# EasyEDA Pro project BLDC_DRIVER_REUSEPhase.eprj

# Schematic singlephaseschem
Create Date: 2024-09-21; Page Name: P1; Project Name: BLDC_DRIVER_REUSEPhase; Schematic Name: singlephaseschem; Update Date: 2024-09-21; Company: EasyEDA.com; Drawn: EasyEDA; Page Size: A4; Part Number: JLCPCB-002; Reviewed: EasyEDA; Version: V0.1
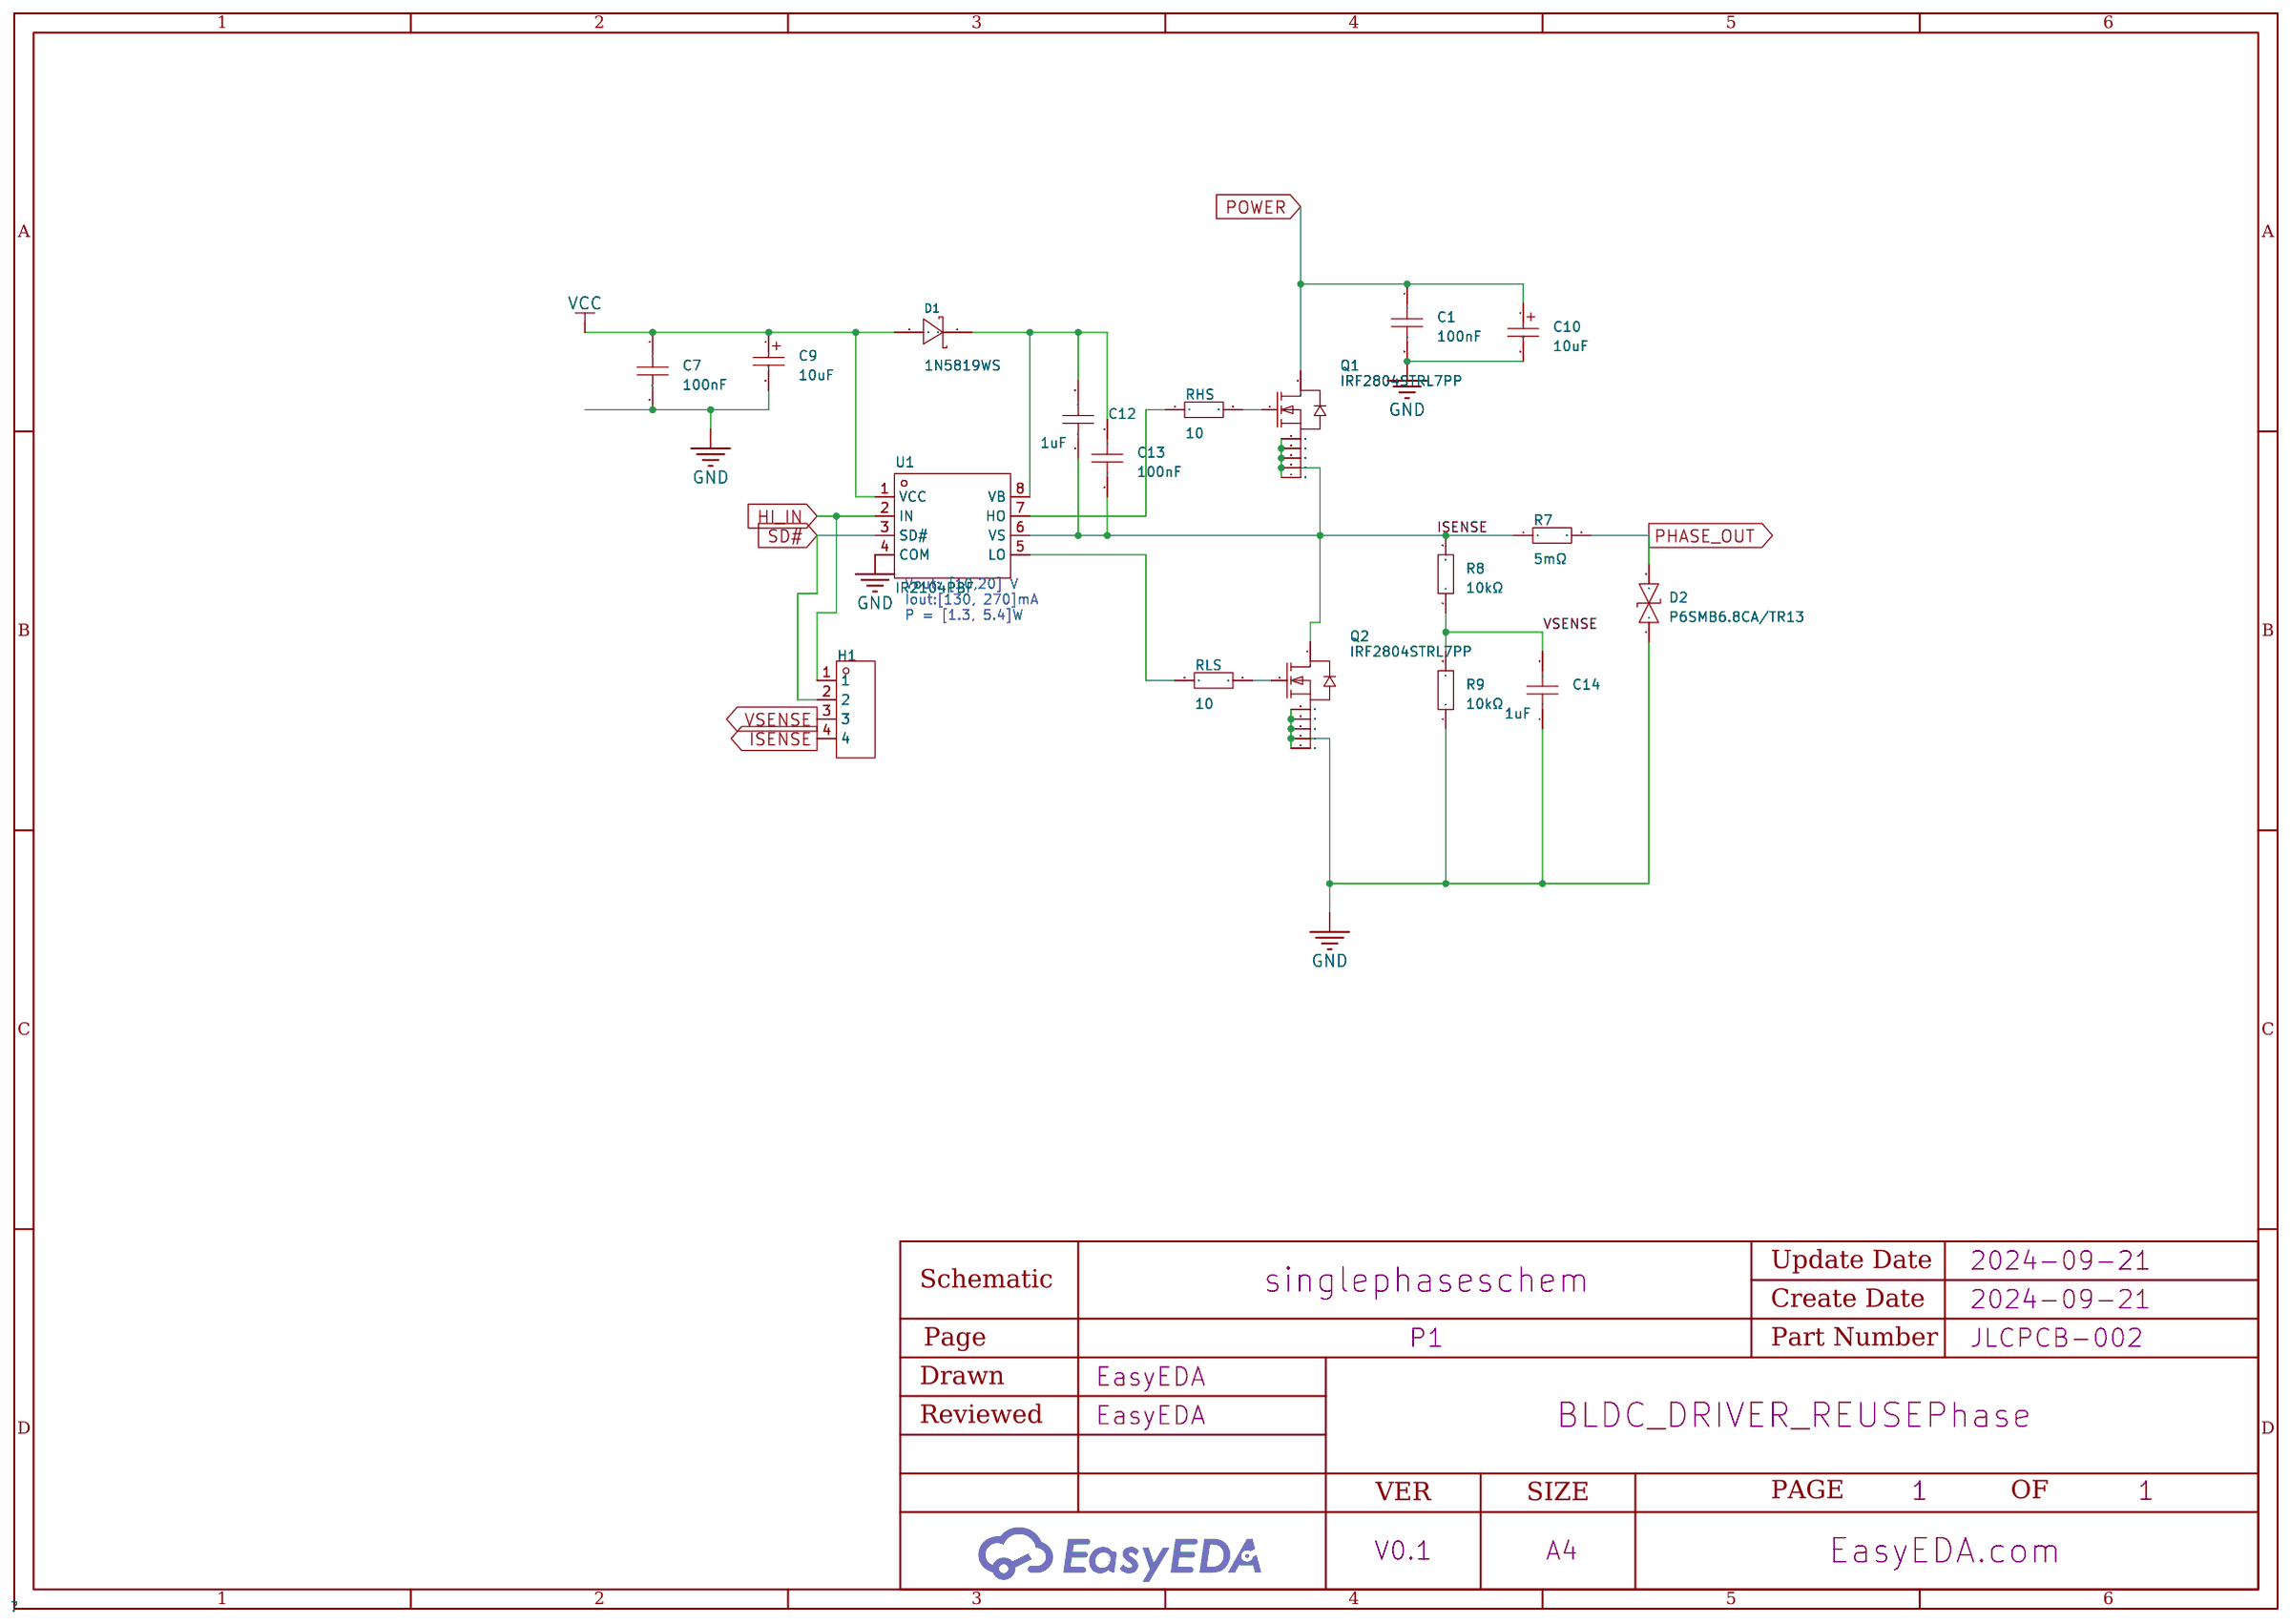
[diagram p0: schematic sheet]

## Parts
C1  100nF  [C0603]
C7  100nF  [C0603]
C9  10uF  [CAP-SMD_BD5.0-L5.3-W5.3-LS6.3-FD]
C10  10uF  [CAP-SMD_BD5.0-L5.3-W5.3-LS6.3-FD]
C12  1uF  [CAP-TH_L7.2-W2.5-P5.00-D0.6]
C13  100nF  [C0603]
C14  1uF  [CAP-TH_L7.2-W2.5-P5.00-D0.6]
D1  1N5819WS  [SOD-323_L1.8-W1.3-LS2.5-RD]
D2  P6SMB6.8CA/TR13  [SMB_L4.6-W3.6-LS5.3-BI]
H1  -  [HDR-TH_4P-P2.54-V-M]
Q1  IRF2804STRL7PP  [D2PAK-7_L10.6-W9.6-P1.27-LS15.9-BR]
Q2  IRF2804STRL7PP  [D2PAK-7_L10.6-W9.6-P1.27-LS15.9-BR]
R7  5mΩ  [R2512]
R8  10kΩ  [RES-TH_BD3.3-L9.0-P13.00-D0.6]
R9  10kΩ  [RES-TH_BD3.3-L9.0-P13.00-D0.6]
RHS  10  [R1210]
RLS  10  [R1210]
U1  IR2104PBF  [DIP-8_L9.9-W6.6-P2.54-LS7.62-BL]

## Library data of the parts
C1 C7 C13 = CAP_0603: Supplier Footprint: 0603
C9 C10 = C_Ele_SMD_5x5.4mm: Supplier Footprint: SMD,5x5.4mm
C12 C14 = SMEC334J100M2: Capacitance: Tolerance:±5% Tolerance:±5% Voltage Rated:; LCSC Part Name: 330nF ±5% 100V; Supplier Part: C401104; Manufacturer: CHAMPION(全鹏); Supplier Footprint: 插件,P=5mm; JLCPCB Part Class: Extended Part; Datasheet: https://atta.szlcsc.com/upload/public/pdf/source/20190730/C401104_3330673C3D333BC9993FC47731C2A492.pdf; Supplier: LCSC; Tolerance: ±5%
D1 = 1N5819WS_C191023: Forward Voltage (Vf@If):600mV@1A Reverse Voltage (Vr):40V Average Rectified Current (Io):1A; LCSC Part Name: 电压:40V 电流:1A; Supplier Part: C191023; Manufacturer: Hottech(合科泰); Supplier Footprint: SOD-323; JLCPCB Part Class: Basic Part; Datasheet: https://atta.szlcsc.com/upload/public/pdf/source/20220428/3CB86FD8D28D653594B4E35F9D5AEFD9.pdf; Supplier: LCSC; Forward Voltage (Vf@If): 600mV@1A; Reverse Voltage (Vr): 40V; Average Rectified Current (Io): 1A
D2 = P6SMB6.8CA/TR13: Reverse Stand-Off Voltage (Vrwm):5.8V Maximum Clamping Voltage:10.5V Peak Pulse Current (Ipp)@10/1000us:58.1A Peak Pulse Power Dissipation (Ppp)@10/1000us:600W Breakdown Voltage:6.45V Type:TVS; Supplier Part: C78395; Manufacturer: Brightking(君耀电子); Supplier Footprint: SMB(DO-214AA); JLCPCB Part Class: Basic Part; Datasheet: https://atta.szlcsc.com/upload/public/pdf/source/20160709/1468031879762.pdf; Supplier: LCSC; Reverse Stand-Off Voltage (Vrwm): 5.8V; Maximum Clamping Voltage: 10.5V; Peak Pulse Current (Ipp)@10/1000us: 58.1A; Peak Pulse Power Dissipation (Ppp)@10/1000us: 600W; Breakdown Voltage: 6.45V; Type: TVS
H1 = HDR-M_2.54_1x4P: Supplier Footprint: Through
Q1 Q2 = IRF2804STRL7PP: Supplier Part: C459950; Manufacturer: Infineon(英飞凌); Supplier Footprint: TO-252-3; JLCPCB Part Class: Extended Part; Datasheet: https://atta.szlcsc.com/upload/public/pdf/source/20211220/39CD65D483719D465F1A88FFAD2C5DF5.pdf; Supplier: LCSC
R7 = PA2512FKF7W0R005E: Type:Current Sensing Resistors Resistance: Tolerance:±1% Tolerance:±1% Power(Watts): Temperature Coefficient:±100ppm/℃ Temperature Coefficient:±100ppm/℃; LCSC Part Name: 5mΩ ±1% 2W; Supplier Part: C309526; Manufacturer: YAGEO(国巨); Supplier Footprint: 2512; JLCPCB Part Class: Extended Part; Datasheet: https://atta.szlcsc.com/upload/public/pdf/source/20190227/C375693_219964CC8B3EBD36DBDF701587FA5938.pdf; Supplier: LCSC; Type: Current Sensing Resistors; Tolerance: ±1%; Temperature Coefficient: ±100ppm/℃
R8 R9 = Res_AXIAL-1/2W: Supplier Footprint: Through
RHS RLS = Res_1210: Supplier Footprint: 1210
U1 = IR2104PBF: Driven Configuration:Half Bridge Load Type:MOSFET；IGBT Number of Drivers:2 Peak Output Current(sink):360mA Peak Output Current(source):210mA Supply Voltage:10V~20V Supply Voltage:10V~20V Rise Time:100ns Fall Time:50ns Operating Temperature:-40℃~+150℃@(Tj); LCSC Part Name: IR2104PBF 停产; Supplier Part: C2959; Manufacturer: Infineon(英飞凌); Supplier Footprint: PDIP-8; JLCPCB Part Class: Extended Part; Datasheet: https://atta.szlcsc.com/upload/public/pdf/source/20140906/1457707236579.pdf; Supplier: LCSC; Driven Configuration: Half Bridge; Load Type: MOSFET；IGBT; Number of Drivers: 2; Peak Output Current(sink): 360mA; Peak Output Current(source): 210mA; Supply Voltage: 10V~20V; Rise Time: 100ns; Fall Time: 50ns; Operating Temperature: -40℃~+150℃@(Tj)

## Nets
GND: C1.2 C7.2 C9.2 C10.2 C14.1 D2.1 Q2.2(S) Q2.3(S) Q2.5(S) Q2.6(S) Q2.7(S) R9.1 U1.4(COM)
VCC: C7.1 C9.1 D1.2(A) U1.1(VCC)
HI_IN: H1.1 U1.2(IN)
ISENSE: C12.1 C13.2 H1.4 Q1.2(S) Q1.3(S) Q1.5(S) Q1.6(S) Q1.7(S) Q2.4(D) R7.1 R8.2 U1.6(VS)
PHASE_OUT: D2.2 R7.2
POWER: C1.1 C10.1 Q1.4(D)
SD#: H1.2 U1.3(SD#)
VSENSE: C14.2 H1.3 R8.1 R9.2
$1N697: RHS.1 U1.7(HO)
$1N698: Q1.1(G) RHS.2
$1N699: RLS.1 U1.5(LO)
$1N700: Q2.1(G) RLS.2
$1N2600: C12.2 C13.1 D1.1(K) U1.8(VB)

## Notes on the sheet
- Vout: [10,20] V
  Iout:[130, 270]mA
  P = [1.3, 5.4]W

# Board PCB4_1
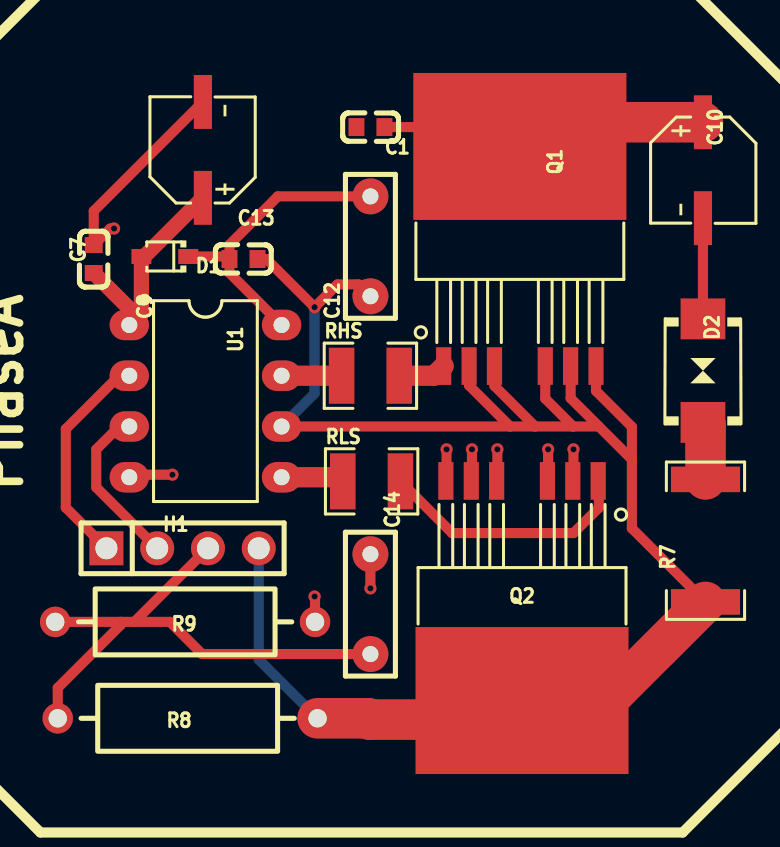
[diagram p1: board, top side]
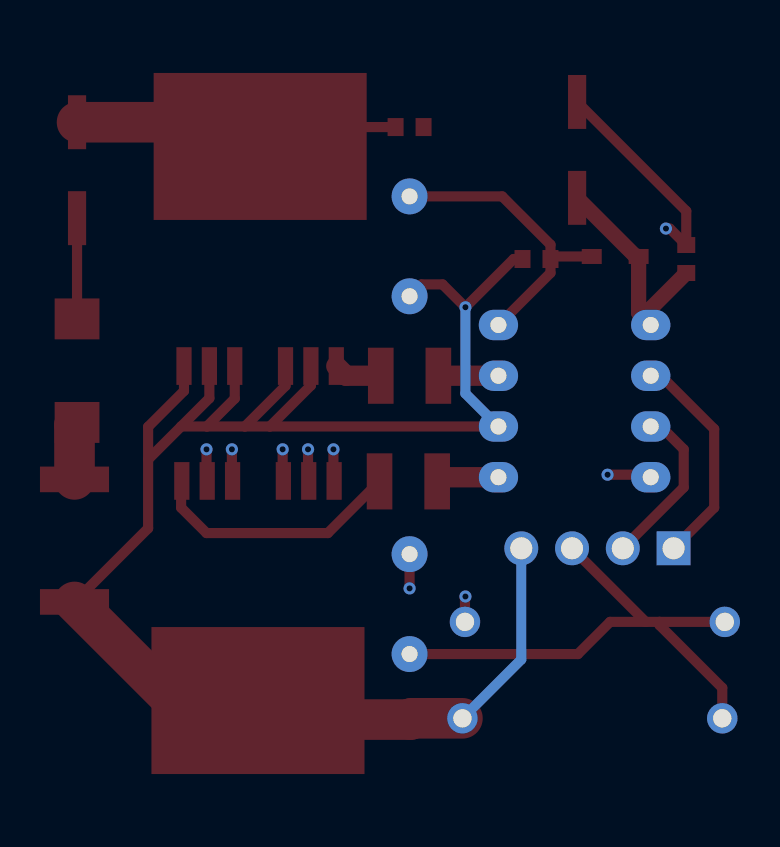
[diagram p2: board, bottom side, seen from below]

No outline. copper layers: Top Layer, Bottom Layer. Coordinates in mm from the lowest, leftmost part position.
Stack: Top Layer 0.035mm / Dielectric1 1.51mm FR4 er 4.5 / Bottom Layer 0.035mm

## Design rules (mm)
template: JLCPCB Capability(Two Layers Board)
spacing copperThickness1oz (default): track to track 0.102, other pairs 0.152 to 0.3
spacing copperThickness2oz: track to track 0.203, other pairs 0.152 to 0.3
track width copperThickness1oz (default): min 0.127, default 0.254, max 2.54
track width copperThickness2oz: min 0.203, default 0.254, max 2.54
differential pair differentialPair (default): width min 0.127, default 0.254, max 2.54; gap min 0.152, default 0.152
via viaSize (default): diameter min 0.5, default 0.61, max 10; hole min 0.3, default 0.305, max 6.3

## Placement (name value [footprint] x y rotation side)
C1  100nF  [C0603]  13.84 29.59 180 top
C7  100nF  [C0603]  0 22.99 90 top
C9  10uF  [CAP-SMD_BD5.0-L5.3-W5.3-LS6.3-FD]  5.46 28.45 90 top
C10  10uF  [CAP-SMD_BD5.0-L5.3-W5.3-LS6.3-FD]  30.48 27.43 270 top
C12  1uF  [CAP-TH_L7.2-W2.5-P5.00-D0.6]  13.84 23.62 90 top
C13  100nF  [C0603]  7.49 22.99 0 top
C14  1uF  [CAP-TH_L7.2-W2.5-P5.00-D0.6]  13.84 5.72 270 top
D1  1N5819WS  [SOD-323_L1.8-W1.3-LS2.5-RD]  3.56 23.11 180 top
D2  P6SMB6.8CA/TR13  [SMB_L4.6-W3.6-LS5.3-BI]  30.48 17.4 270 top
H1  -  [HDR-TH_4P-P2.54-V-M]  4.44 8.51 0 top
Q1  IRF2804STRL7PP  [D2PAK-7_L10.6-W9.6-P1.27-LS15.9-BR]  21.32 23.12 270 top
Q2  IRF2804STRL7PP  [D2PAK-7_L10.6-W9.6-P1.27-LS15.9-BR]  21.43 6.38 90 top
R7  5mΩ  [R2512]  30.61 8.89 90 top
R8  10kΩ  [RES-TH_BD3.3-L9.0-P13.00-D0.6]  4.7 0 0 top
R9  10kΩ  [RES-TH_BD3.3-L9.0-P13.00-D0.6]  4.57 4.83 180 top
RHS  10  [R1210]  13.84 17.14 0 top
RLS  10  [R1210]  13.9 11.86 0 top
U1  IR2104PBF  [DIP-8_L9.9-W6.6-P2.54-LS7.62-BL]  5.59 15.88 270 top

## Footprints (pads in the part's own frame, mm; a bottom-side part is the same pattern mirrored in y, then rotated)
C0603
  rect 0.8x0.9 smd: 1(-0.7,0) 2(0.7,0)
CAP-SMD_BD5.0-L5.3-W5.3-LS6.3-FD
  rect 2.7x0.91 smd: 1(-2.4,0) 2(2.4,0)
CAP-TH_L7.2-W2.5-P5.00-D0.6
  round 1.8 hole 0.8: 1(-2.499,0) 2(2.499,0)
D2PAK-7_L10.6-W9.6-P1.27-LS15.9-BR
  rect 1.887x0.762 smd: 1(5.495,-3.81) 2(5.495,-2.54) 3(5.495,-1.27) 5(5.495,1.27) 6(5.495,2.54) 7(5.495,3.81)
  rect 7.356x10.66 smd: 4(-5.495,0)
DIP-8_L9.9-W6.6-P2.54-LS7.62-BL
  oval 1.524x1.97 hole 0.8: 1(-3.81,-3.81) 2(-1.27,-3.81) 3(1.27,-3.81) 4(3.81,-3.81) 5(3.81,3.81) 6(1.27,3.81) 7(-1.27,3.81) 8(-3.81,3.81)
HDR-TH_4P-P2.54-V-M
  rect 1.7x1.7 hole 1.1: 1(-3.81,0)
  round 1.7 hole 1.1: 2(-1.27,0) 3(1.27,0) 4(3.81,0)
R1210
  rect 1.282x2.808 smd: 1(-1.441,0) 2(1.441,0)
R2512
  rect 1.282x3.456 smd: 1(-3.067,0) 2(3.067,0)
RES-TH_BD3.3-L9.0-P13.00-D0.6
  round 1.524 hole 0.914: 1(-6.5,0) 2(6.5,0)
SMB_L4.6-W3.6-LS5.3-BI
  rect 2.047x2.241 smd: 1(-2.591,0) 2(2.591,0)
SOD-323_L1.8-W1.3-LS2.5-RD
  rect 1x0.75 smd: 1(-1.173,0) 2(1.173,0)

## Nets
As in the schematic, except:
VCC: C1.1 C10.1 Q1.4
$1N2292: C7.1 C9.1 D1.2 U1.1

## Via types
v1: diameter 0.61, hole 0.305, Top Layer to Bottom Layer, 10 vias

## Routing (per net, layer and track width the routed paths; a pad name or vN(x,y) marks a point on that pad's centre or on a via; arc(x,y) is an arc through that point)
GND: length 29
  Top Layer w0.508: v1(17.65,13.46) 17.65,11.92 Q2.7 ; D2.1 C10.2 ; Q2.6 18.92,11.92 v1(18.92,13.46) ; v1(3.94,12.19) 1.91,12.19 U1.4 ; Q2.5 20.19,11.92 v1(20.19,13.46) ; v1(13.84,6.5) C14.1 ; Q2.2 24,11.92 v1(24,13.46) ; R9.1 11.07,6.07 v1(11.05,6.1) ; C9.2 0,25.39 C7.2 0.82,24.51 v1(1.02,24.51) ; Q2.3 22.73,11.92 v1(22.73,13.46)
VCC: length 16.8
  Top Layer w0.508: Q1.4 20.35,29.59 C1.1
  Top Layer w2.032: C10.1 22.53,29.83 Q1.4
HI_IN: length 11.1
  Top Layer w0.508: U1.2 1.27,17.14 -1.4,14.48 -1.4,10.54 H1.1
ISENSE: length 93.4
  Top Layer w0.508: Q1.2 18.78,16.66 20.83,14.61 ; C12.1 13.25,21.72 12.19,21.72 v1(11.05,20.57) 8.64,22.99 C13.2 ; 23.99,14.61 22.59,16 Q1.5 ; 23.99,14.61 25.27,14.61 ; 23.99,14.61 22.08,14.61 ; 26.92,12.95 26.92,9.51 R7.1 30.61,6.33 ; 26.92,12.95 25.27,14.61 ; 26.92,12.95 26.92,14.59 25.13,16.38 Q1.7 ; 25.27,14.61 23.86,16.02 Q1.6 ; 22.08,14.61 20.05,16.64 Q1.3 ; 22.08,14.61 20.83,14.61 ; 20.83,14.61 U1.6
  Top Layer w2.032: R7.1 25.67,0.89 Q2.4 20.48,-0.06 13.8,-0.06 13.74,0 R8.2
  Bottom Layer w0.508: H1.4 8.25,2.94 R8.2 ; v1(11.05,20.57) 11.05,16.26 U1.6
PHASE_OUT: length 2.9
  Top Layer w2.032: R7.2 30.61,14.68 D2.2
SD#: length 8.3
  Top Layer w0.508: U1.3 1.27,14.61 0.13,13.46 0.13,11.56 H1.2
VSENSE: length 27.3
  Top Layer w0.508: 2.03,4.83 3.81,4.83 5.42,3.22 C14.2 ; 2.03,4.83 H1.3 ; 2.03,4.83 1.34,4.83 ; -1.8,0.51 -1.8,1.52 1.34,4.66 1.34,4.83 ; 1.34,4.83 R9.2
$1N697: length 3
  Top Layer w1.016: U1.7 RHS.1
$1N698: length 2.4
  Top Layer w1.016: RHS.2 17.03,17.14 Q1.1
$1N699: length 3.1
  Top Layer w1.016: U1.5 12.25,12.06 RLS.1
$1N700: length 12.9
  Top Layer w0.508: RLS.2 17.93,9.27 24,9.27 25.27,10.54 25.27,11.85 Q2.1
$1N2292: length 11.3
  Top Layer w0.762: C7.1 1.78,20.51 U1.1 2.38,20.29 D1.2 2.53,23.11 C9.1
$1N2600: length 15.3
  Top Layer w0.508: C13.1 6.79,22.29 U1.8 ; C13.1 6.79,23.71 9.21,26.12 C12.2 ; C13.1 6.67,23.11 D1.1

## Text on the board
Top Silkscreen Layer: PhaseA
